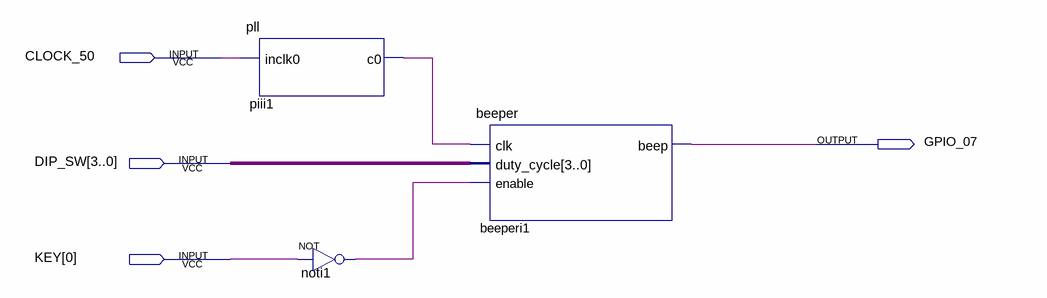
[diagram p0: schematic sheet]
// Quartus schematic toplevel.bdf as structural Verilog: 3 symbols, 4 pins
module toplevel (
  input  CLOCK_50,
  input  [3:0] DIP_SW,
  input  [0:0] KEY,
  output GPIO_07
);

  wire noti1_out, piii1_c0;

  pll piii1 (.inclk0(CLOCK_50), .c0(piii1_c0));
  not noti1 (noti1_out, KEY[0]);
  beeper beeperi1 (.clk(piii1_c0), .duty_cycle(DIP_SW), .enable(noti1_out), .beep(GPIO_07));
endmodule
